# Altium project DC_CDI_Honda_CX500_rev1.1.PrjPcb
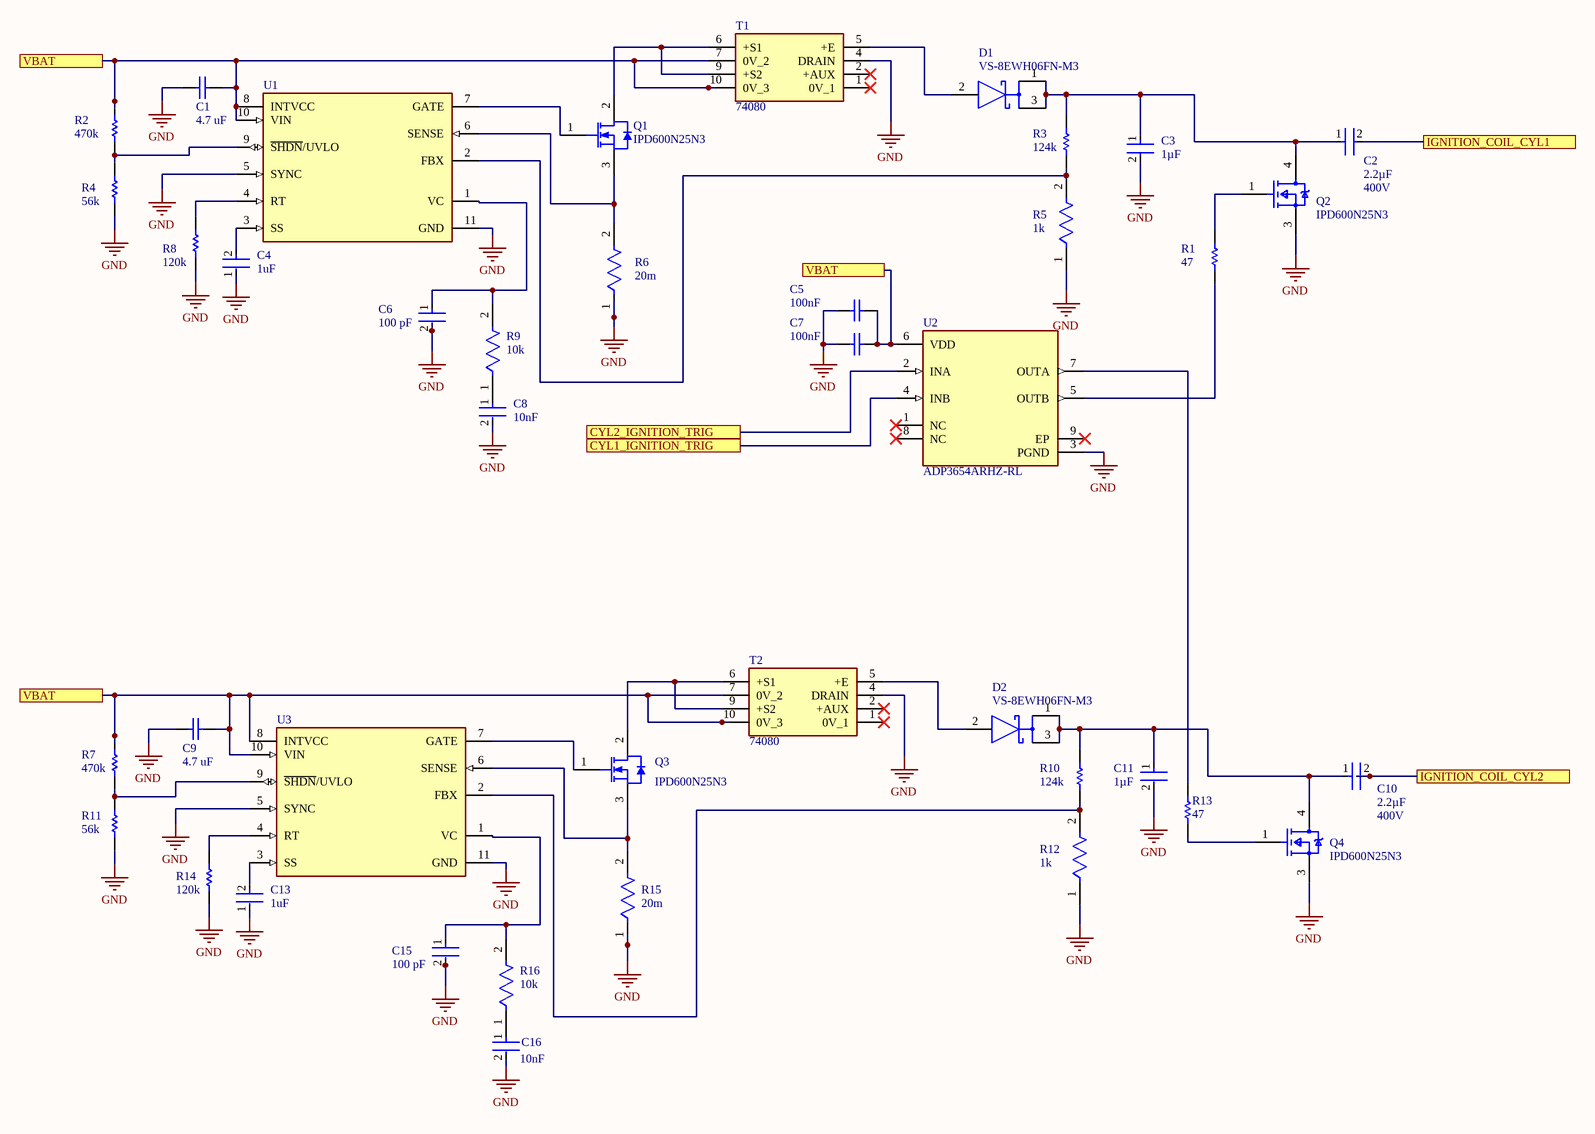
[diagram p0: power_side.SchDoc]
3 sheets, 82 parts. Net scope: flat (ports and power ports of the same name join across sheets).
Board file: dc_cdi_pcb_2.PcbDoc
Sheets:
  power_side.SchDoc
  input_output.SchDoc
  input_filter.SchDoc

## Sheet power_side.SchDoc: Power Side
size A3; SheetNumber: 1; SheetTotal: 4

### Parts
C1  Capacitance: 4.7 uF  [CAPC2013X135X45LL10T25]  (hidden comment: GRM21BR61C475KA88L)
C2  Voltage Rating (AC): 400V  Capacitance: 2.2µF  [FP-BFC233820225-MFG]  (hidden comment: BFC233820225)
C3  Capacitance: 1µF  [FP-B32672Z4105K000-MFG]  (hidden comment: B32672Z4105K000)
C4  Capacitance: 1uF  [FP-C1608-080-0_1-IPC_B]  (hidden comment: C1608X5R1H105K080AB)
C5  value 100nF  [CAPC1608X90X35LL15T15]  (hidden comment: 06035C104KAT4A)
C6  Capacitance: 100 pF  [FP-CC0603-DA-MFG]  (hidden comment: CC0603KRX7R9BB101)
C7  value 100nF  [CAPC1608X87X35NL15T15]  (hidden comment: C0603C475K8PACTU)
C8  Capacitance: 10nF  [FP-0603-L_1_6_0_15-W_0_81-MFG]  (hidden comment: 06035C103KAT2A)
C9  Capacitance: 4.7 uF  [CAPC2013X135X45LL10T25]  (hidden comment: GRM21BR61C475KA88L)
C10  Voltage Rating (AC): 400V  Capacitance: 2.2µF  [FP-BFC233820225-MFG]  (hidden comment: BFC233820225)
C11  Capacitance: 1µF  [FP-B32672Z4105K000-MFG]  (hidden comment: B32672Z4105K000)
C13  Capacitance: 1uF  [FP-C1608-080-0_1-IPC_B]  (hidden comment: C1608X5R1H105K080AB)
C15  Capacitance: 100 pF  [FP-CC0603-DA-MFG]  (hidden comment: CC0603KRX7R9BB101)
C16  Capacitance: 10nF  [FP-0603-L_1_6_0_15-W_0_81-MFG]  (hidden comment: 06035C103KAT2A)
D1  PN: VS-8EWH06FN-M3  [FP-TO-252-2_v2-MFG]  (hidden comment: C3D03060E)
D2  PN: VS-8EWH06FN-M3  [FP-TO-252-2_v2-MFG]  (hidden comment: C3D03060E)
Q1  IPD600N25N3  [INF-PG-TO252-3-11_A_L]
Q2  IPD600N25N3  [FP-PG-TO252-3-MFG]
Q3  IPD600N25N3  [INF-PG-TO252-3-11_A_L]
Q4  IPD600N25N3  [FP-PG-TO252-3-MFG]
R1  value 47  [RESC1609X50X30LL10T20]  (hidden comment: CRCW060347R0FKEA)
R2  value 470k  [RESC1608X55X25ML10T15]  (hidden comment: RC0603FR-07470KL)
R3  value 124k  [RESC1608X55X30LL15T15]  (hidden comment: ERJ-3EKF1243V)
R4  value 56k  [RESC1608X55X25LL10T15]  (hidden comment: RC0603FR-0756KL)
R5  value 1k  [FP-RC0603-0_55-IPC_C]  (hidden comment: RC0603FR-071KL)
R6  value 20m  [FP-CRA2512-MFG]  (hidden comment: CRA2512-FZ-R020ELF)
R7  value 470k  [RESC1608X55X25ML10T15]  (hidden comment: RC0603FR-07470KL)
R8  value 120k  [RESC1608X55X25NL10T15]  (hidden comment: RC0603FR-07120KL)
R9  Resistance: 10k  [FP-RC0603-0_55-IPC_C]  (hidden comment: RC0603FR-0710KL)
R10  value 124k  [RESC1608X55X30LL15T15]  (hidden comment: ERJ-3EKF1243V)
R11  Resistance: 56k  [RESC1608X55X25LL10T15]  (hidden comment: RC0603FR-0756KL)
R12  value 1k  [FP-RC0603-0_55-IPC_C]  (hidden comment: RC0603FR-071KL)
R13  value 47  [RESC1609X50X30LL10T20]  (hidden comment: CRCW060347R0FKEA)
R14  value 120k  [RESC1608X55X25NL10T15]  (hidden comment: RC0603FR-07120KL)
R15  value 20m  [FP-CRA2512-MFG]  (hidden comment: CRA2512-FZ-R020ELF)
R16  Resistance: 10k  [FP-RC0603-0_55-IPC_C]  (hidden comment: RC0603FR-0710KL)
T1  74080  [74080]
T2  74080  [74080]
U1  LT3758EDD#PBF  [FP-DD-10-05-08-1699-IPC_B]  (value not drawn)
U2  ADP3654ARHZ-RL  [FP-RH-8-1-IPC_C]
U3  LT3758EDD#PBF  [FP-DD-10-05-08-1699-IPC_B]  (value not drawn)

### Ports
CYL1_IGNITION_TRIG (see logic_000[8A]), CYL2_IGNITION_TRIG (see logic_000[4A]), IGNITION_COIL_CYL1 (see input_output[2B]), IGNITION_COIL_CYL2 (see input_output[2B]), VBAT (see input_output[7A], logic_000[3C], power_side[2A], power_side[2C]), VBAT (see input_output[7A], logic_000[3C], power_side[2A], power_side[5B]), VBAT (see input_output[7A], logic_000[3C], power_side[2C], power_side[5B])

### Nets
+12: C1.2 C5.1 C7.2 C9.2 R2.2 R7.2 T1.7(0V_2) T1.10(0V_3) T2.7(0V_2) T2.10(0V_3) U1.8(INTVCC) U1.10(VIN) U2.6(VDD) U3.8(INTVCC) U3.10(VIN) ; port VBAT
GND: C1.1 C3.2 C4.1 C5.2 C6.2 C7.1 C8.2 C9.1 C11.2 C13.1 C15.2 C16.2 Q2.3(SOURCE) Q4.3(SOURCE) R4.1 R5.1 R6.1 R8.1 R11.1 R12.1 R14.1 R15.1 T1.4(DRAIN) T2.4(DRAIN) U1.5(SYNC) U1.11(GND) U2.3(PGND) U3.5(SYNC) U3.11(GND)
NetC2_1: C2.1 C3.1 D1.1(C) D1.3(C) Q2.4(DRAIN) R3.2
NetC2_2: C2.2 ; port IGNITION_COIL_CYL1
NetC4_2: C4.2 U1.3(SS)
NetC6_1: C6.1 R9.2 U1.1(VC)
NetC8_1: C8.1 R9.1
NetC10_1: C10.1 C11.1 D2.1(C) D2.3(C) Q4.4(DRAIN) R10.2
NetC10_2: C10.2 ; port IGNITION_COIL_CYL2
NetC13_2: C13.2 U3.3(SS)
NetC15_1: C15.1 R16.2 U3.1(VC)
NetC16_1: C16.1 R16.1
NetD1_2: D1.2(A) T1.5(+E)
NetD2_2: D2.2(A) T2.5(+E)
NetQ1_1: Q1.1(GATE) U1.7(GATE)
NetQ1_2: Q1.2(DRAIN) T1.6(+S1) T1.9(+S2)
NetQ1_3: Q1.3(SOURCE) R6.2 U1.6(SENSE)
NetQ2_1: Q2.1(GATE) R1.2
NetQ3_1: Q3.1(GATE) U3.7(GATE)
NetQ3_2: Q3.2(DRAIN) T2.6(+S1) T2.9(+S2)
NetQ3_3: Q3.3(SOURCE) R15.2 U3.6(SENSE)
NetQ4_1: Q4.1(GATE) R13.1
NetR1_1: R1.1 U2.5(OUTB)
NetR2_1: R2.1 R4.2 U1.9(~{SHDN}/UVLO)
NetR3_1: R3.1 R5.2 U1.2(FBX)
NetR7_1: R7.1 R11.2 U3.9(~{SHDN}/UVLO)
NetR8_2: R8.2 U1.4(RT)
NetR10_1: R10.1 R12.2 U3.2(FBX)
NetR13_2: R13.2 U2.7(OUTA)
NetR14_2: R14.2 U3.4(RT)
NetU2_2: U2.2(INA) ; port CYL2_IGNITION_TRIG
NetU2_4: U2.4(INB) ; port CYL1_IGNITION_TRIG

Not connected (* = marked no-connect by the designer): T1 1(0V_1)* 2(+AUX)*; T2 1(0V_1)* 2(+AUX)*; U2 1(NC)* 8(NC)* 9(EP)*

### Library data of the parts
C1 C9 = CMP-1662-00015-2: Chip Capacitor, 4.7 uF, +/- 10%, 16 V, -55 to 85 degC, 0805 (2012 Metric), RoHS, Tape and Reel; Voltage Rating (DC): 16 V; Type (Capacitors): X5R; Case\/Package: 0805; Pins: 2; DatasheetVersion: 03/2016; REACH SVHC: No SVHC; Tolerance: 10%; PartNumber: GRM21BR61C475KA88L; Width: 1.25 mm; Mount: Surface Mount; ComponentLink1Description: Manufacturer URL; Case Code (Metric): 2012; PackageDescription: 2-Pin Surface Mount Device, Body 2 x 1.25 mm; Height: 1.25 mm; Voltage Rating: 16 V; Max Operating Temperature: 85 degC; RoHSCompliant: true; Length: 2 mm; ComponentLink1URL: http://www.murata.com/; Mounting Technology: Surface Mount; Packaging: Tape and Reel; Min Operating Temperature: -55 degC; ComponentLink2Description: Datasheet; Case Code (Imperial): 0805; Radiation Hardening: No; Package Quantity: 3000; PackageReference: 0805; ComponentLink2URL: http://search.murata.co.jp/Ceramy/image/img/A01X/G101/ENG/GRM21BR61C475KA88-01.pdf
C2 C10 = CMP-00030-39758189-1: BFC233820225 Film Capacitor, Polypropylene, 800V, 20% +Tol, 20% -Tol, 0.22uF, Through Hole Mount; Insulation Resistance: 11GΩ; Lead Diameter: 800µm; Voltage Rating (DC): 630V; Dielectric: PP; Packaging: Bulk; Lead Pitch: 27.5mm; Number of Pins: 2; Contact Plating: Tin; Height - Seated (Max): 24.9936mm; Width: 15.0114mm; Min Operating Temperature: -55°C; Lead Free: Lead Free; Length: 31.5mm; Schedule B: 8532250020, 8532250020; Depth: 15mm; NexarPartId: 39758189; Max Operating Temperature: 110°C; Tolerance: 20%; Dielectric Material: PP; RoHS: Compliant; Height: 28mm; Case/Package: Radial; Diameter: 18mm; Termination: Radial; Voltage Rating: 630V; REACH SVHC: Unknown; Radiation Hardening: No; Mount: Through Hole
C3 C11 = CMP-00131-19048049-1: B32672Z4105K000 Film Capacitor, Polypropylene, 450V, 10% +Tol, 10% -Tol, 1uF, Through Hole Mount, 7143; Lead Diameter: 800µm; Voltage Rating (AC): 220V; Dielectric: PP; Case/Package: Radial; Voltage Rating (DC): 450V; Width: 10.9982mm; Length: 18mm; Features: General Purpose; Max Length: 18mm; NexarPartId: 19048049; Termination: PC Pins; Height - Seated (Max): 18.4912mm; Radiation Hardening: No; Dielectric Material: Polypropylene; Mount: Through Hole; Voltage Rating: 450V; RoHS: Compliant; REACH SVHC: No SVHC; Tolerance: 10%; Lifecycle Status: Production; Max Operating Temperature: 125°C; Max Width: 11mm; Lead Pitch: 15mm; Depth: 11mm; Min Operating Temperature: -55°C; Packaging: Bulk; Height: 18.5mm
C4 C13 = CMP-2000-06025-2: Multilayer Ceramic Capacitors 1μF ±10% 50V X5R SMD 0603; Lead Free: Lead Free; Height: 0.8mm; Mount: Surface Mount; Radiation Hardening: No; Thickness: 0.035inch; Length: 1.6mm; Max Operating Temperature: 85°C; REACH SVHC: No SVHC; Min Operating Temperature: -55°C; Construction: Flat; RoHS Compliant: Yes; Voltage Rating: 50V; Dielectric: X5R; Packaging: Tape and Reel; Termination: SMD/SMT; Voltage Rating (DC): 50V; Case Code (Imperial): 0603; Voltage: 50V; Width: 0.031inch; Weight: 7.1E-05oz; Depth: 0.8mm; Case Code (Metric): 1608; Series: C; Case/Package: 0603; Tolerance: 10%; Resistor Type: Ceramic; Number of Pins: 2; Dielectric Material: Ceramic; Package Quantity: 1
C5 = CMP-2006-04390-1: Manufacturer: AVX Interconnect / Elco; Part Number: 06035C104KAT4A
C6 C15 = CMP-03422-000747-1: CAP CER 100PF 50V X7R 0603; Manufacturer: YAGEO; Material: Ceramic; Tolerance: 0.1; Temperature Coefficient: 15%; Temperature: -55°C to +125°C; Device Class L3: Ceramic Capacitors; Value: 100 pF; Manufacturer Part Number: CC0603KRX7R9BB101; Temperature Range High: +125°C; Footprint Url: http://www.yageo.com/exep/pages/download/literatures/UPY-C_GEN_24.pdf; Device Class L1: Passive Components; ComponentLink2URL: http://www.yageo.com/documents/recent/UPY-GPHC_X7R_6.3V-to-50V_18.pdf; Octopart: https://octopart.com/cc0603krx7r9bb101-yageo-42334526; RoHS: TRUE; Device Class L2: Capacitors; Mouser Description: Multilayer Ceramic Capacitor, CC Series, 100 pF, - 10%, X7R, 50 V, 0603 [1608 Metric]; Voltage Rating: 50 V; Digikey Description: CAP CER 100PF 50V X7R 0603; Category: Cap; Voltage: 50 V; Package: CC0603-DA; Automotive: No; ComponentLink2Description: Datasheet; Lead Free: Yes; Temperature Range Low: -55°C; Height: 0.9mm; Temperature Characteristic: X7R
C7 = CMP-2006-03238-1: Manufacturer: Kemet; Part Number: C0603C475K8PACTU
C8 C16 = CMP-2006-04374-2: General Purpose Ceramic Capacitor, 0603, 10nF, 10%, X7R, 15%, 50V; Insulation Resistance: 100GR; Dissipation Factor: 2.5%; Voltage: 50V; Number of Pins: 2; Min Operating Temperature: -55°C; Mount: Surface Mount; Width: 0.032inch; Height: 0.9mm; Voltage Rating: 50V; Termination: SMD/SMT; Package Quantity: 1; Dielectric: X7R; Max Operating Temperature: 125°C; Contact Plating: Tin; Length: 1.6mm; Dielectric Material: Ceramic; REACH SVHC: No SVHC; Case Code (Imperial): 0603; Depth: 0.81mm; Thickness: 0.035inch; Packaging: Tape and Reel; Tolerance: 10%; Lead Free: Lead Free; Voltage Rating (DC): 50V; Radiation Hardening: No; Case/Package: 0603; Case Code (Metric): 1608
D1 D2 = CMP-240925-000041-3: DIODE SCHOTTKY 600V 3A TO252-2; Max Surge Current: 100A; Max Power Dissipation: 53W; Element Configuration: Single; Max Reverse Current: 100uA; Forward Voltage: 1.7V; Reverse Recovery Time: 0ns; Average Rectified Current: 11A; Max Reverse Leakage Current: 50uA; Length: 7.34mm; Package Quantity: 75; Case/Package: TO-252; Max Reverse Voltage (DC): 600V; Width: 7.518mm; Radiation Hardening: No; Peak Non-Repetitive Surge Current: 100A; Max Repetitive Reverse Voltage (Vrrm): 600V; Termination: Through Hole; Min Operating Temperature: -55°C; Mount: Surface Mount; Forward Current: 3A; Height: 2.388mm; Packaging: Rail/Tube; Max Forward Surge Current (Ifsm): 100A; Series: Z-Rec®; Number of Pins: 2; Max Operating Temperature: 175°C; RoHS Compliant: Yes
Q1 Q3 = CMP-1091-00172-1: N-Channel OptiMOS 3 Power-Transistor, 60 V VDS, 90 A ID, -55 to 175 degC, PG-TO252-3-11, Reel, Green; PartNumber: IPD035N06L3 G; Manufacturer: Infineon; RthJC (max): 0.9Â K/W; ID (max): 90Â A; RDS (on) (max): 3.5Â mOhm; VDS (max): 60Â V; VGS(th) (max): 2.2Â V; Polarity: N; RDS (on) (max) (@4.5V): 5.5Â mOhm; Ptot (max): 167Â W; RthJA (max): 62 K/W; QG: 59Â nC; VGS(th) (min): 1.2Â V; Green: TRUE; IDpuls (max): 360Â A; PackageVersion: Rev. 02, 03/2007; ComponentLink1URL: http://www.infineon.com/; Rth: 0.9Â K/W; ComponentLink2URL: http://www.infineon.com/dgdl/IPD035N06L3_Rev2.3.pdf?folderId=db3a304313b8b5a60113cee8763b02d7&fileId=db3a30431b3e89eb011b4558ed7f7d14; ComponentLink1Description: Manufacturer URL; DatasheetVersion: Rev. 2.3; ComponentLink2Description: Datasheet; Halogen-free: TRUE; PackageDescription: 3-Pin Plastic (Green) Transistor Single Outline Package, 6.57 x 6.1 mm Body, 2.29 mm Pitch; Mounting Technology: Surface Mount; Packing: Reel; PackageReference: PG-TO252-3-11; ComponentLink3Description: Package Specification; ComponentLink3URL: http://www.infineon.com/dgdl/IPD160N04L_rev1.0.pdf?folderId=db3a3043163797a6011643468e7505a4&fileId=db3a3043163797a60116436401cf05cf
Q2 Q4 = CMP-32901-000143-1: MOSFET N-CH 30V 161A DPAK; Manufacturer Part Number: IRLR7843TRPBF; Manufacturer: Infineon; Drain To Source Resistance: 3.2mΩ; Depletion Mode: False; Reverse Recovery Time: 39ns; Reverse Recovery Charge: 36nC; Threshold Vgs Max: 2.3V; Rthja Max: 50°C/W; Threshold Vgs Min: 1.4V; Power Dissipation: 140W; Pulse Drain Current: 620A; Input Capacitace At Vds: 4380pF @ 15V; Turn On Delay Time: 25ns; Gate To Source Voltage: 20V; Max Forward Diode Voltage: 1V; Gate Charge At Vgs: 34nC @ 4.5V; Max Junction Temp: +175°C; Number Of Channels: 1; Turn Off Delay Time: 34ns; ComponentLink2URL: https://www.infineon.com/dgdl/irlr7843pbf.pdf?fileId=5546d462533600a40153566de53526d8; Temperature Range High: +175°C; Octopart: https://octopart.com/irlr7843trpbf-infineon-65875062; Temperature: -55°C to +175°C; Device Class L3: MOSFETs; Category: Trans; Package: PG-TO252-3; Footprint Url: https://www.infineon.com/cms/en/product/packages/PG-TO252/PG-TO252-3-901/; Continuous Drain Current: 161A; Digikey Description: MOSFET N-CH 30V 161A DPAK; Automotive: No; Lead Free: Yes; Drain To Source Breakdown Voltage: 30V; Height: 2.52mm; Temperature Range Low: -55°C; RoHS: TRUE; Number Of N Channels: 1; Drain To Source Voltage: 30V; ComponentLink2Description: Datasheet; Device Class L2: Transistors; Device Class L1: Discrete Semiconductors
R1 R13 = CMP-2000-03383-1: Manufacturer: Vishay Dale; Part Number: CRCW060347R0FKEA
R2 R7 = CMP-1659-00049-1: Chip Resistor, 470 KOhm, +/- 1%, 0.1 W, -55 to 155 degC, 0603 (1608 Metric), RoHS, Tape and Reel; ComponentLink1Description: Manufacturer URL; ComponentLink2Description: Datasheet; ComponentLink2URL: http://www.yageo.com/documents/recent/PYu-RC_Group_51_RoHS_L_04.pdf; PackageReference: 0603; DatasheetVersion: Rev. 4, 02/2016; ComponentLink1URL: http://www.yageo.com/; PackageDescription: 2-Pin Surface Mount Device, Body 1.6 x 0.8 mm
R3 R10 = CMP-2000-00225-1: Manufacturer: Panasonic; Part Number: ERJ-3EKF1243V
R4 = CMP-2000-06943-1: Chip Resistor, 56 KOhm, +/- 1%, 0.1 W, -55 to 155 degC, 0603 (1608 Metric), RoHS, Tape and Reel; Manufacturer: Yageo; Resistance: 56kOhms; Temperature Coefficient: 100PPM/C; Power Rating: 100mW; Voltage Rating: 75V; Unit Weight: 0.000071oz; Datasheet Version: Rev. 7, 05/2017; Operating Temperature Range: -55Cto+155C; Product: ThickFilmResistorsGeneralPurpose; Case Code - mm: 1608; Termination Style: SMD/SMT; Package Reference: 0603; Brand: Yageo; Height: 0.45mm; Series: RC; Package / Case: 0603(1608metric); Type: GeneralPurposeChipResistorSurfaceMount; Packaging: Reel; Manufacturer URL: http://www.yageo.com/; Package Description: 2-Pin Surface Mount Device, Body 1.6 x 0.8 mm; RoHS: True; Mounting Technology: SurfaceMount; Datasheet URL: http://www.yageo.com/documents/recent/PYu-RC_Group_51_RoHS_L_7.pdf; Width: 0.8mm; Length: 1.6mm; Product Category: ThickFilmResistors; Tolerance: 1%; Case Code - in: 0603
R5 R12 = CMP-1659-00009-5: RES 1K OHM 1% 1/10W 0603; Resistance: 1kR; Voltage Rating: 50V; Power Rating: 100mW; Temperature Coefficient: 100ppm/°C; Military Standard: Not; REACH SVHC: No SVHC; Size Code: 0603; Features: Moisture Resistant; Number of Terminations: 2; Technology: THICK FILM; Series: RC; Case Code (Metric): 1608; Resistance Tolerance: 1%; Resistor Type: Thick Film; Termination: SMD/SMT; Contact Plating: Tin; Radiation Hardening: No; Min Operating Temperature: -55°C; Max Operating Temperature: 155°C; Packaging: Tape and Reel; Max Power Dissipation: 100mW; RoHS Compliant: Yes; Height: 0.45mm; Lead Free: Lead Free; Case/Package: 0603; Length: 1.6mm; Tolerance: 1%; Case Code (Imperial): 0603; Construction: Rectangular; Depth: 0.8mm
R6 R15 = CMP-07231-006693-1: RES 0.02 OHM 1% 3W 2512
R8 R14 = CMP-1659-00024-2: Chip Resistor, 120 KOhm, +/- 1%, 100 mW, -55 to 155 degC, 0603 (1608 Metric), RoHS, Tape and Reel; Capacitance: 22 pF; Voltage Rating (DC): 100 V; Tolerance: 10%; Type (Capacitors): C0G; Case\Package: Radial; Package Quantity: 500; ComponentLink2URL: http://www.yageo.com/documents/recent/PYu-RC_Group_51_RoHS_L_04.pdf; RoHSCompliant: true; Lead Pitch: 2.54 mm; Length: 5.33 mm; PackageDescription: 2-Pin Surface Mount Device, Body 1.6 x 0.8 mm; Height: 2.54 mm; Voltage Rating: 100 V; ComponentLink1Description: Manufacturer URL; ComponentLink1URL: http://www.yageo.com/; Min Operating Temperature: -55 degC; ComponentLink2Description: Datasheet; Width: 3.81 mm; Packaging: Bulk; Mount: Through Hole; Radiation Hardening: No; DatasheetVersion: Rev. 4, 02/2016; PackageReference: 0603; Max Operating Temperature: 125 degC
R9 R16 = CMP-2100-03664-2: RES 10K OHM 1% 1/10W 0603; Voltage Rating: 75V; Voltage Rating (DC): 50V; Power Rating: 100mW; Temperature Coefficient: 100ppm/°C; Depth: 0.8mm; Termination: SMD/SMT; Resistor Type: Thick Film; Series: RC; Construction: Rectangular; Features: Moisture Resistant; Packaging: Tape and Reel; Min Operating Temperature: -55°C; Number of Terminations: 2; Lead Pitch: 0.3mm; RoHS Compliant: Yes; Case/Package: 0603; Resistance Tolerance: 1%; Military Standard: Not; Weight: 7.1E-05oz; Number of Pins: 2; Tolerance: 1%; Length: 1.6mm; Case Code (Imperial): 0603; Lead Free: Lead Free; Width: 0.8mm; Max Power Dissipation: 100mW; Height: 0.45mm; Max Operating Temperature: 155°C; Case Code (Metric): 1608; Size Code: 0603
R11 = CMP-2000-06943-1: Chip Resistor, 56 KOhm, +/- 1%, 0.1 W, -55 to 155 degC, 0603 (1608 Metric), RoHS, Tape and Reel; Manufacturer: Yageo; Temperature Coefficient: 100PPM/C; Power Rating: 100mW; Voltage Rating: 75V; Unit Weight: 0.000071oz; Datasheet Version: Rev. 7, 05/2017; Operating Temperature Range: -55Cto+155C; Product: ThickFilmResistorsGeneralPurpose; Case Code - mm: 1608; Termination Style: SMD/SMT; Package Reference: 0603; Brand: Yageo; Height: 0.45mm; Series: RC; Package / Case: 0603(1608metric); Type: GeneralPurposeChipResistorSurfaceMount; Packaging: Reel; Manufacturer URL: http://www.yageo.com/; Package Description: 2-Pin Surface Mount Device, Body 1.6 x 0.8 mm; RoHS: True; Mounting Technology: SurfaceMount; Datasheet URL: http://www.yageo.com/documents/recent/PYu-RC_Group_51_RoHS_L_7.pdf; Width: 0.8mm; Length: 1.6mm; Product Category: ThickFilmResistors; Tolerance: 1%; Case Code - in: 0603; Value: *
T1 T2 = 74080: Transformer; Manufacturer_Name: MYRRA; Datasheet Link: https://www.tme.com/Document/74b1c6fdfa5c80edd28be424718b4d1b/74080.pdf; Height: 18mm; Manufacturer_Part_Number: 74080
U1 U3 = CMP-09139-000585-1: IC REG CTRLR MULT TOPOLOGY 10DFN; Max Input Voltage: 100V; Number of Outputs: 1; Max Output Voltage: 12V; Max Output Current: 1.2A; Max Frequency: 1MHz; Min Input Voltage: 5.5V; Topology: Boost; Mount: Surface Mount; Min Operating Temperature: -40°C; REACH SVHC: No SVHC; Max Operating Temperature: 125°C; Output Voltage: 100V; Max Supply Voltage: 100V; Switching Frequency: 1MHz; Case/Package: DFN; Package Quantity: 121; Series: -; Packaging: Rail/Tube; RoHS Compliant: Yes; Width: 3mm; Min Supply Voltage: 5.5V; Number of Pins: 10; Length: 3mm; Height: 0.7mm
U2 = CMP-09133-000023-1: IC GATE DRVR LOW-SIDE 8MINISOIC; Number of Outputs: 2; Min Supply Voltage: 4.5V; Output Current: 4A; Max Supply Current: 3mA; Rise Time: 14ns; Fall Time: 25ns; Max Supply Voltage: 18V; Turn-On Delay Time: 35ns; Channel Type: Independent; Package Quantity: 3000; RoHS Compliant: Yes; Series: -; Max Operating Temperature: 125°C; Mount: Surface Mount; Max Output Current: 4A; Lead Free: Contains Lead; Supply Current: 3mA; Packaging: Tape and Reel; Case/Package: MSOP; Min Operating Temperature: -40°C; Min Input Voltage: 4.5V; Max Input Voltage: 18V; Number of Drivers: 2; Nominal Supply Current: 3mA; Number of Pins: 8; Propagation Delay: 35ns

## Sheet input_output.SchDoc: Input - Output
size A3; SheetNumber: 2; SheetTotal: 4
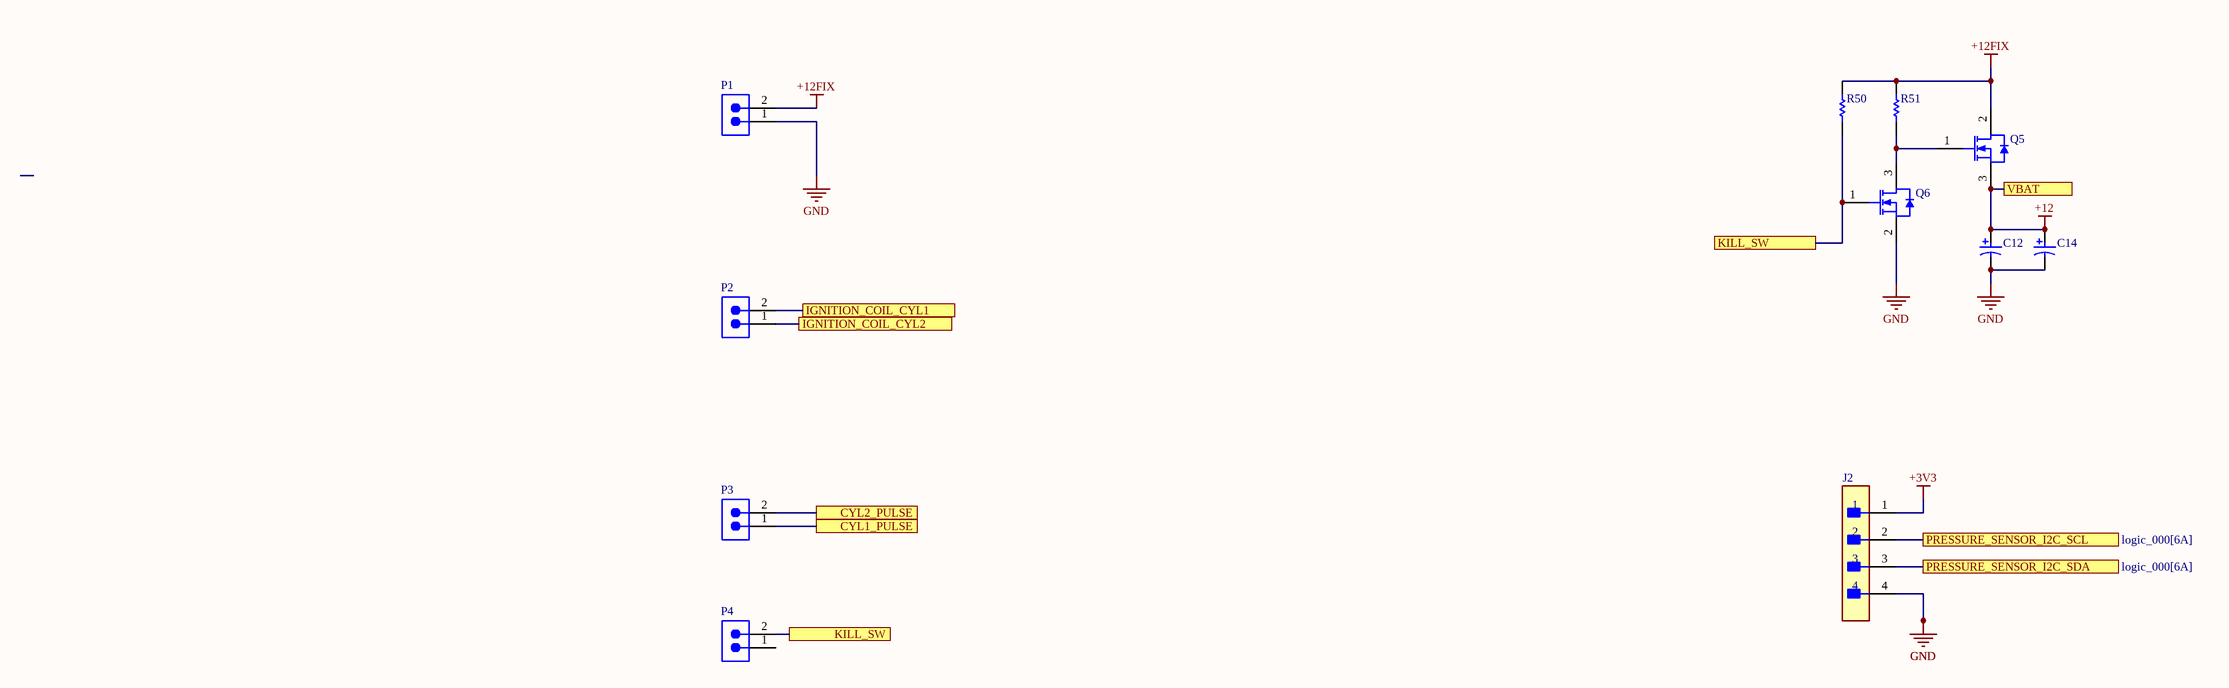
[diagram p1: input_output.SchDoc]

### Parts
C12  UUD1A102MNL1GS  [NIC-CAPA2-10X10_V]  (value not drawn)
C14  UUD1A102MNL1GS  [NIC-CAPA2-10X10_V]  (value not drawn)
J2  53047-0410  [FP-53047-0410-MFG]  (value not drawn)
P1  691701510002B  [691701510002B]  (value not drawn)
P2  691701510002B  [691701510002B]  (value not drawn)
P3  691701510002B  [691701510002B]  (value not drawn)
P4  691701510002B  [691701510002B]  (value not drawn)
Q5  IPD600N25N3  [INF-PG-TO252-3-11_A_L]  (value not drawn)
Q6  PMV56XN,215  [NXP-SOT23_L]  (value not drawn)
R50  RC0603FR-07470KL  [RESC1608X55X25ML10T15]  (value not drawn)
R51  RC0603FR-07470KL  [RESC1608X55X25ML10T15]  (value not drawn)

### Ports
CYL1_PULSE (see input_filter[3A]), CYL2_PULSE (see input_filter[3B]), IGNITION_COIL_CYL1 (see power_side[7A]), IGNITION_COIL_CYL2 (see power_side[7C]), KILL_SW (see input_output[2C]), KILL_SW (see input_output[6B]), PRESSURE_SENSOR_I2C_SCL (see logic_000[6A]), PRESSURE_SENSOR_I2C_SDA (see logic_000[6A]), VBAT (see logic_000[3C], power_side[2A], power_side[2C], power_side[5B])

### Nets
+3V3: J2.1
+12: C12.1 C14.1 Q5.3(SOURCE) ; port VBAT
+12FIX: P1.2 Q5.2(DRAIN) R50.2 R51.2
GND: C12.2 C14.2 J2.4 P1.1 Q6.2(S)
NetC2_2: P2.2 ; port IGNITION_COIL_CYL1
NetC10_2: P2.1 ; port IGNITION_COIL_CYL2
NetJ2_2: J2.2 ; port PRESSURE_SENSOR_I2C_SCL
NetJ2_3: J2.3 ; port PRESSURE_SENSOR_I2C_SDA
NetP3_1: P3.1 ; port CYL1_PULSE
NetP3_2: P3.2 ; port CYL2_PULSE
NetP4_2: P4.2 Q6.1(G) R50.1 ; port KILL_SW
NetQ5_1: Q5.1(GATE) Q6.3(D) R51.1

Not connected (* = marked no-connect by the designer): P4 1

### Library data of the parts
C12 C14 = CMP-0687-00006-1: Aluminum Electrolytic Capacitor, UD Series, Low Impedance, 1000 uF, 10 V, + / - 20%, -55 to 105 degC, Chip Type, 10 x 10 mm D x L, Pb-Free, Reel; Manufacturer: Nichicon; Rated Voltage: 10 V; Rated Capacitance: 1000 uF; Endurance Time: 5000 h; Impedance: 0.09 Ohm; Packing: Dia382mm Reel; Tolerance Rated Capacitance: -20 to 20%; Rated Ripple Current (at 100kHz): 670 mA; DatasheetVersion: 08/2012; PackageReference: CAPAE-D10H10; PackageDescription: 2-Pin Surface Mount Device, Diameter 10 mm, Height 10 mm, Pitch 8 mm; ComponentLink3URL: http://products.nichicon.co.jp/en/pdf/XJA043/e-ud.pdf; ComponentLink2Description: Datasheet; Diameter: 10 mm; ComponentLink1Description: Manufacturer URL; RoHS: TRUE; ComponentLink2URL: http://products.nichicon.co.jp/en/pdf/XJA043/e-ud.pdf; Length: 10 mm; ComponentLink1URL: http://www.nichicon.co.jp/; Mounting Technology: Surface Mount; PartNumber: UUD1A102MNL1GS; ComponentLink3Description: Package Specification
J2 = CMP-04776-000321-1: CONN HEADER VERT 4POS 1.25MM; Plating: Tin; Number of Positions: 4; Voltage Rating (AC): 125V; Insulation Resistance: 100MR; Current Rating: 1A; Glow Wire Compliant: Non-compliant; Contact Resistance: 20mR; Gender: Male; Series: PicoBlade; Contact Material: Bronze; Number of Circuits: 4; Voltage Rating (DC): 125V; Working Voltage: 125V; Termination: Solder; Pitch: 1.25mm; Housing Material: Polyamide; Orientation: Vertical; Current: 1A; Flammability Rating: UL94 V-0; Max Voltage Rating (AC): 125V; Housing Color: Natural; Package Quantity: 5000; Mount: Through Hole; Case/Package: 0410; Max Operating Temperature: 85°C; RoHS Compliant: Yes; Voltage Rating: 125V; Lead Free: Lead Free; Packaging: Tray; Color: Natural; Contact Plating: Tin; Number of Rows: 1; Radiation Hardening: No; Min Operating Temperature: -40°C; Voltage: 125V; Number of Contacts: 4
P1-P4 = CMP-1502-02329-2: NexarPartId: 22866752; Connector Type: Terminal Block; Current Rating: 10A; Voltage Rating: 300V; Number of Contacts: 2; Gender: Male; Pitch: 5.08mm; RoHS: Compliant; Contact Gender: Male; Lead Pitch: 5.08mm; Termination: PCB; Color: Black; Housing Material: Polymer; Length: 12.96mm; Mount: Through Hole; Contact Plating: Tin; Max Operating Temperature: 105°C; REACH SVHC: Unknown; Number of Pins: 2; Min Operating Temperature: -40°C; Contact Material: Brass
Q5 = CMP-1091-00172-1: as Q1 on sheet power_side; PackageVersion: Rev. 02, 03/2007; ComponentLink1URL: http://www.infineon.com/; Rth: 0.9Â K/W; ComponentLink2URL: http://www.infineon.com/dgdl/IPD035N06L3_Rev2.3.pdf?folderId=db3a304313b8b5a60113cee8763b02d7&fileId=db3a30431b3e89eb011b4558ed7f7d14; ComponentLink1Description: Manufacturer URL; DatasheetVersion: Rev. 2.3; ComponentLink2Description: Datasheet; Halogen-free: TRUE; PackageDescription: 3-Pin Plastic (Green) Transistor Single Outline Package, 6.57 x 6.1 mm Body, 2.29 mm Pitch; Mounting Technology: Surface Mount; Packing: Reel; PackageReference: PG-TO252-3-11; ComponentLink3Description: Package Specification; ComponentLink3URL: http://www.infineon.com/dgdl/IPD160N04L_rev1.0.pdf?folderId=db3a3043163797a6011643468e7505a4&fileId=db3a3043163797a60116436401cf05cf
Q6 = CMP-1258-00163-1: N-Channel uTrenchMOS(TM) Extremely Low Level FET, 20 V, 3.76 A, 3-Pin SOT23, Tape and Reel; Manufacturer: NXP Semiconductors; VDS [max] (V): 20; Channel Type: N; Packing: Tape & Reel; Coss [typ] (pF): 125; Ciss [typ] (pF): 230; ID [max] (A): 3.76; PartNumber: PMV56XN,215; Mounting Technology: Surface Mount; ComponentLink1Description: Manufacturer URL; DatasheetVersion: Rev. 02; ComponentLink2URL: http://www.nxp.com/documents/data_sheet/PMV56XN.pdf; PackageVersion: 06-03-16, 03/2006; PackageDescription: 3-Pin Small Outline Transistor Package, Body 2.9 x 1.3 mm, Pitch 0.95 mm; ComponentLink1URL: http://www.nxp.com/; Code_JEDEC: TO-236AB; ComponentLink3URL: http://www.nxp.com/documents/outline_drawing/sot023_po.pdf; PackageReference: SOT23; ComponentLink2Description: Datasheet; ComponentLink3Description: Package Specification
R50 R51 = CMP-1659-00049-1: as R2 on sheet power_side; ComponentLink1Description: Manufacturer URL; ComponentLink2Description: Datasheet; ComponentLink2URL: http://www.yageo.com/documents/recent/PYu-RC_Group_51_RoHS_L_04.pdf; PackageReference: 0603; DatasheetVersion: Rev. 4, 02/2016; ComponentLink1URL: http://www.yageo.com/; PackageDescription: 2-Pin Surface Mount Device, Body 1.6 x 0.8 mm

## Sheet input_filter.SchDoc: Filtering
size A3; SheetNumber: 3; SheetTotal: 4
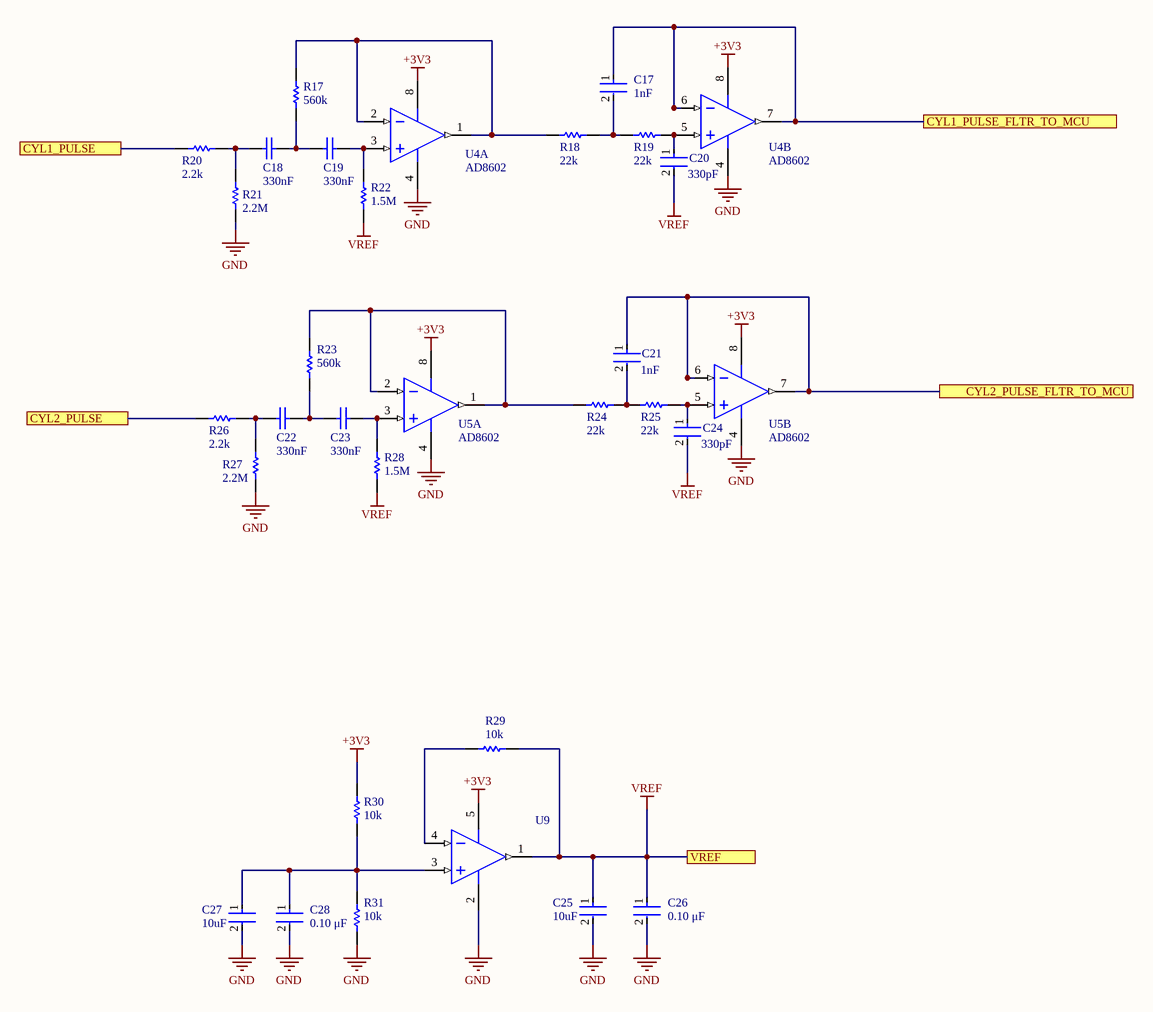
[diagram p2: input_filter.SchDoc]

### Parts
C17  Capacitance: 1nF  [FP-GRM155-0_05-IPC_B]  (hidden comment: GRM1555C1H102JA01D)
C18  value 330nF  [CAPC1005X55X25ML05T10]  (hidden comment: GRM155R61A334KE15D)
C19  value 330nF  [CAPC1005X55X25ML05T10]  (hidden comment: GRM155R61A334KE15D)
C20  Capacitance: 330pF  [FP-GRM155-0_05-MFG]  (hidden comment: GRM1555C1H331JA01D)
C21  Capacitance: 1nF  [FP-GRM155-0_05-IPC_B]  (hidden comment: GRM1555C1H102JA01D)
C22  value 330nF  [CAPC1005X55X25ML05T10]  (hidden comment: GRM155R61A334KE15D)
C23  value 330nF  [CAPC1005X55X25ML05T10]  (hidden comment: GRM155R61A334KE15D)
C24  Capacitance: 330pF  [FP-GRM155-0_05-MFG]  (hidden comment: GRM1555C1H331JA01D)
C25  Capacitance: 10uF  [FP-CL05A106MP5NUNC-MFG]  (hidden comment: CL05A106MP5NUNC)
C26  Capacitance: 0.10 μF  [FP-C0402-BB-MFG]  (hidden comment: C0402C104K8PACTU)
C27  Capacitance: 10uF  [FP-CL05A106MP5NUNC-MFG]  (hidden comment: CL05A106MP5NUNC)
C28  value 0.10 μF  [FP-C0402-BB-MFG]  (hidden comment: C0402C104K8PACTU)
R17  value 560k  [RESC1005X40X25LL05T10]  (hidden comment: RC0402FR-07560KL)
R18  value 22k  [RESC1005X40X25NL05T10]  (hidden comment: RC0402FR-0722KL)
R19  value 22k  [RESC1005X40X25NL05T10]  (hidden comment: RC0402FR-0722KL)
R20  value 2.2k  [RESC1005X40X25NL05T10]  (hidden comment: RC0402FR-0722KL)
R21  value 2.2M  [RESC1005X40X25ML05T10]  (hidden comment: RC0402FR-072M2L)
R22  value 1.5M  [RESC1005X40X25NL05T10]  (hidden comment: RC0402FR-071M5L)
R23  value 560k  [RESC1005X40X25LL05T10]  (hidden comment: RC0402FR-07560KL)
R24  value 22k  [RESC1005X40X25NL05T10]  (hidden comment: RC0402FR-0722KL)
R25  value 22k  [RESC1005X40X25NL05T10]  (hidden comment: RC0402FR-0722KL)
R26  value 2.2k  [RESC1005X40X25NL05T10]  (hidden comment: RC0402FR-0722KL)
R27  value 2.2M  [RESC1005X40X25ML05T10]  (hidden comment: RC0402FR-072M2L)
R28  value 1.5M  [RESC1005X40X25NL05T10]  (hidden comment: RC0402FR-071M5L)
R29  value 10k  [RESC1005X40X25LL05T10]  (hidden comment: RC0402FR-0710KL)
R30  value 10k  [RESC1005X40X25LL05T10]  (hidden comment: RC0402FR-0710KL)
R31  value 10k  [RESC1005X40X25LL05T10]  (hidden comment: RC0402FR-0710KL)
U4  Generic Part Number: AD8602  [ADI-RM-8_M]  (hidden comment: AD8602DRM-REEL)  (parts A,B of 2)
U5  Generic Part Number: AD8602  [ADI-RM-8_M]  (hidden comment: AD8602DRM-REEL)  (parts A,B of 2)
U9  AD8031ARTZ-REEL7  [ADI-RJ-5_L]  (value not drawn)

### Ports
CYL1_PULSE (see input_output[2B]), CYL1_PULSE_FLTR_TO_MCU (see logic_000[4A]), CYL2_PULSE (see input_output[2B]), CYL2_PULSE_FLTR_TO_MCU (see logic_000[4A]), VREF

### Nets
+3V3: R30.1 U4.8(+V) U5.8(+V) U9.5(+VS)
GND: C25.2 C26.2 C27.2 C28.2 R21.1 R27.1 R31.2 U4.4(-V) U5.4(-V) U9.2(-VS)
VREF: C20.2 C24.2 C25.1 C26.1 R22.1 R28.1 R29.1 U9.1(VOUT) ; port VREF
NetC17_1: C17.1 U4.6(-IN_B) U4.7(OUT_B) ; port CYL1_PULSE_FLTR_TO_MCU
NetC17_2: C17.2 R18.2 R19.1
NetC18_1: C18.1 R20.2 R21.2
NetC18_2: C18.2 C19.1 R17.1
NetC19_2: C19.2 R22.2 U4.3(+IN_A)
NetC20_1: C20.1 R19.2 U4.5(+IN_B)
NetC21_1: C21.1 U5.6(-IN_B) U5.7(OUT_B) ; port CYL2_PULSE_FLTR_TO_MCU
NetC21_2: C21.2 R24.2 R25.1
NetC22_1: C22.1 R26.2 R27.2
NetC22_2: C22.2 C23.1 R23.1
NetC23_2: C23.2 R28.2 U5.3(+IN_A)
NetC24_1: C24.1 R25.2 U5.5(+IN_B)
NetC27_1: C27.1 C28.1 R30.2 R31.1 U9.3(+IN)
NetP3_1: R20.1 ; port CYL1_PULSE
NetP3_2: R26.1 ; port CYL2_PULSE
NetR17_2: R17.2 R18.1 U4.1(OUT_A) U4.2(-IN_A)
NetR23_2: R23.2 R24.1 U5.1(OUT_A) U5.2(-IN_A)
NetR29_2: R29.2 U9.4(-IN)

### Library data of the parts
C17 C21 = CMP-2008-04254-2: Chip Multilayer Ceramic Capacitors for General Purpose, 0402, 1000pF, C0G, 30ppm/°C, 5%, 50V; Insulation Resistance: 10GR; Packaging: Tape and Reel; Lead Free: Lead Free; Tolerance: 5%; Temperature Coefficient: 30ppm/°C; Thickness: 0.022inch; Termination: SMD/SMT; Max Operating Temperature: 125°C; Height: 0.5mm; Package Quantity: 1; Radiation Hardening: No; Material: Ceramic; Case Code (Metric): 1005; Number of Pins: 2; Voltage Rating: 50V; Mount: Surface Mount; Voltage: 50V; Case/Package: 0402; Min Operating Temperature: -55°C; Dielectric Material: Ceramic; Width: 0.5mm; Depth: 0.5mm; Case Code (Imperial): 0402; REACH SVHC: No SVHC; Dielectric: C0G; Voltage Rating (DC): 50V; Length: 1mm
C18 C19 C22 C23 = CMP-2008-03929-1: Manufacturer: Murata; Part Number: GRM155R61A334KE15D
C20 C24 = CMP-06035-004830-1: Chip Multilayer Ceramic Capacitors for General Purpose, 0402, 330pF, C0G, 30ppm/°C, 5%, 50V; Insulation Resistance: 10GR; REACH SVHC: No SVHC; Depth: 0.5mm; Voltage Rating (DC): 50V; Number of Pins: 2; Max Operating Temperature: 125°C; Dielectric: C0G; Tolerance: 5%; Package Quantity: 1; Length: 1mm; Thickness: 0.022inch; Case/Package: 0402; Lead Free: Lead Free; Case Code (Imperial): 0402; Material: Ceramic; Voltage Rating: 50V; Voltage: 50V; Radiation Hardening: No; Min Operating Temperature: -55°C; Packaging: Tape and Reel; Case Code (Metric): 1005; Width: 0.5mm; Mount: Surface Mount; Height: 0.5mm; Temperature Coefficient: 30ppm/°C; Termination: SMD/SMT
C25 C27 = CMP-13271-000002-1: CAP CER 10UF 10V X5R 0402; Manufacturer: Samsung; Temperature Coefficient: 15%; Tolerance: 20%; Material: Ceramic; Octopart: https://octopart.com/cl05a106mp5nunc-samsung-22457395; Voltage Rating: 10V; RoHS: TRUE; Value: 10uF; Height: 0.7mm; Digikey Description: CAP CER 10UF 10V X5R 0402; Automotive: No; Package: CL05A106MP5NUNC; Device Class L1: Passive Components; Temperature Range High: +85°C; ComponentLink2Description: Datasheet; Device Class L2: Capacitors; Temperature Characteristic: X5R; Manufacturer Part Number: CL05A106MP5NUNC; Temperature: -55°C to +85°C; ComponentLink2URL: http://www.samsungsem.com/kr/support/product-search/mlcc/__icsFiles/afieldfile/2019/05/10/19-CL05A106MP5NUNC.pdf; Device Class L3: Ceramic Capacitors; Category: Cap; Temperature Range Low: -55°C; Ipc Land Pattern Name: CAPC10050X50; Lead Free: Yes
C26 = CMP-2008-02046-2: CAP CER 0.1UF 10V X5R 0402; Manufacturer: Kemet; Material: Ceramic; Temperature Coefficient: 15%; Tolerance: 0.1; Value: 0.10 μF; Package: C0402-BB; Temperature: -55°C to +125°C; ComponentLink2Description: Datasheet; Temperature Characteristic: X5R; Device Class L1: Passive Components; Height: 0.55mm; Lead Free: Yes; ComponentLink2URL: https://content.kemet.com/datasheets/KEM_C1002_X7R_SMD.pdf; Device Class L2: Capacitors; Temperature Range Low: -55°C; Temperature Range High: +125°C; RoHS: TRUE; Octopart: https://octopart.com/c0402c104k8pactu-kemet-140039; Automotive: No; Mouser Description: Capacitor 100 nF 10 VDC 0402; Category: Cap; Voltage Rating: 10 V; Digikey Description: CAP CER 0.1UF 10V X5R 0402; Ipc Land Pattern Name: CAPC10050X50; Device Class L3: Ceramic Capacitors; Manufacturer Part Number: C0402C104K8PACTU
C28 = CMP-2008-02046-2: CAP CER 0.1UF 10V X5R 0402; Manufacturer: Kemet; Material: Ceramic; Temperature Coefficient: 15%; Tolerance: 0.1; Package: C0402-BB; Temperature: -55°C to +125°C; ComponentLink2Description: Datasheet; Capacitance: 0.10 μF; Temperature Characteristic: X5R; Device Class L1: Passive Components; Height: 0.55mm; Lead Free: Yes; ComponentLink2URL: https://content.kemet.com/datasheets/KEM_C1002_X7R_SMD.pdf; Device Class L2: Capacitors; Temperature Range Low: -55°C; Temperature Range High: +125°C; RoHS: TRUE; Octopart: https://octopart.com/c0402c104k8pactu-kemet-140039; Automotive: No; Mouser Description: Capacitor 100 nF 10 VDC 0402; Category: Cap; Voltage Rating: 10 V; Digikey Description: CAP CER 0.1UF 10V X5R 0402; Ipc Land Pattern Name: CAPC10050X50; Device Class L3: Ceramic Capacitors; Manufacturer Part Number: C0402C104K8PACTU
R17 R23 = CMP-2002-07031-1: Manufacturer: Yageo / Phycomp; Part Number: RC0402FR-07560KL
R18-R20 R24-R26 = CMP-2002-07517-1: Manufacturer: Yageo / Phycomp; Part Number: RC0402FR-0722KL
  R18: ComponentLink1Description: New link; ComponentLink1URL: *
R21 R27 = CMP-2002-07061-1: Manufacturer: Yageo / Phycomp; Part Number: RC0402FR-072M2L
R22 R28 = CMP-2002-07106-1: Manufacturer: Yageo / Phycomp; Part Number: RC0402FR-071M5L
R29-R31 = CMP-2002-07353-1: Manufacturer: Yageo / Phycomp; Part Number: RC0402FR-0710KL
U4 U5 = CMP-0384-01796-1: Double Channel Wide Bandwidth Operational Amplifier, 8.4 MHz BW, 6 V/us SR, Industrial, 8-pin SOP (RM-8), Reel; Manufacturer: Analog Devices; Automotive Qualified: Yes; Amplifiers Per Package: 2; Iq/Amp: 1.2mA; Small Signal Bandwidth: 8.4MHz; Input Offset Voltage: 500uV; V Span Max: 6V; Slew Rate: 6V/us; Input Bias Current: 200fA; V Span Min: 2.7V; ComponentLink3Description: Package Specification; PackageDescription: 8-Pin Mini Small Outline Package, Body 3 x 3 mm, Pitch 0.65 mm; ComponentLink1URL: http://www.analog.com/en/index.html; ComponentLink2Description: Datasheet; PartNumber: AD8602DRM-REEL; PackageReference: RM-8; ComponentLink3URL: http://www.analog.com/static/imported-files/packages/PKG_PDF/MSOP%28RM%29/RM_8.pdf; DatasheetVersion: Rev. G; ComponentLink2URL: http://www.analog.com/static/imported-files/data_sheets/AD8601_8602_8604.pdf; Mounting Technology: Surface Mount; Code_JEDEC: MO-187-AA; ComponentLink1Description: Manufacturer URL
U9 = CMP-0384-01443-3: Single Channel RRIO Operational Amplifier, 80 MHz BW, 35 V/us SR, Industrial, 5-pin SOT23 (RJ-5), Reel; Manufacturer: Analog Devices; Generic Part Number: AD8031; V Span Max: 12V; Slew Rate: 35V/us; Input Bias Current: 450nA; Amplifiers Per Package: 1; V Span Min: 2.7V; Iq/Amp: 900uA; Small Signal Bandwidth: 80MHz; Input Offset Voltage: 1mV; ComponentLink4URL: http://www.analog.com/en/all-operational-amplifiers-op-amps/operational-amplifiers-op-amps/ad8031/products/product.html#product-recommendations; PackageDescription: 5-Pin Small Outline Transistor Package, Body 2.9 x 1.6 mm, Pitch 0.95 mm; Mounting Technology: Surface Mount; PackageReference: RJ-5; ComponentLink2Description: Datasheet; ComponentLink1Description: Manufacturer URL; PartNumber: AD8031ARTZ-REEL7; ComponentLink2URL: http://www.analog.com/static/imported-files/data_sheets/AD8031_8032.pdf; ComponentLink3URL: http://www.analog.com/static/imported-files/packages/PKG_PDF/SOT-23(RJ)/RJ_5.pdf; ComponentLink1URL: http://www.analog.com/en/index.html; RevisionNote: Reference Circuit URL fixed; ComponentLink3Description: Package Specification; ComponentLink4Description: Reference Circuit; PackageVersion: 121608-A; DatasheetVersion: Rev. D; Packing: Reel; Code_JEDEC: MO-178-AA

## Nets that join several sheets
+3V3: input_output (J2.1), input_filter (R30.1 U4.8 U5.8 U9.5)
+12: power_side (15 pins), input_output (C12.1 C14.1 Q5.3)
GND: power_side (29 pins), input_output (5 pins), input_filter (10 pins)
NetC2_2: power_side (C2.2), input_output (P2.2)
NetC10_2: power_side (C10.2), input_output (P2.1)
NetP3_1: input_output (P3.1), input_filter (R20.1)
NetP3_2: input_output (P3.2), input_filter (R26.1)